# EAGLE design 4relais (EAGLE 5.00)
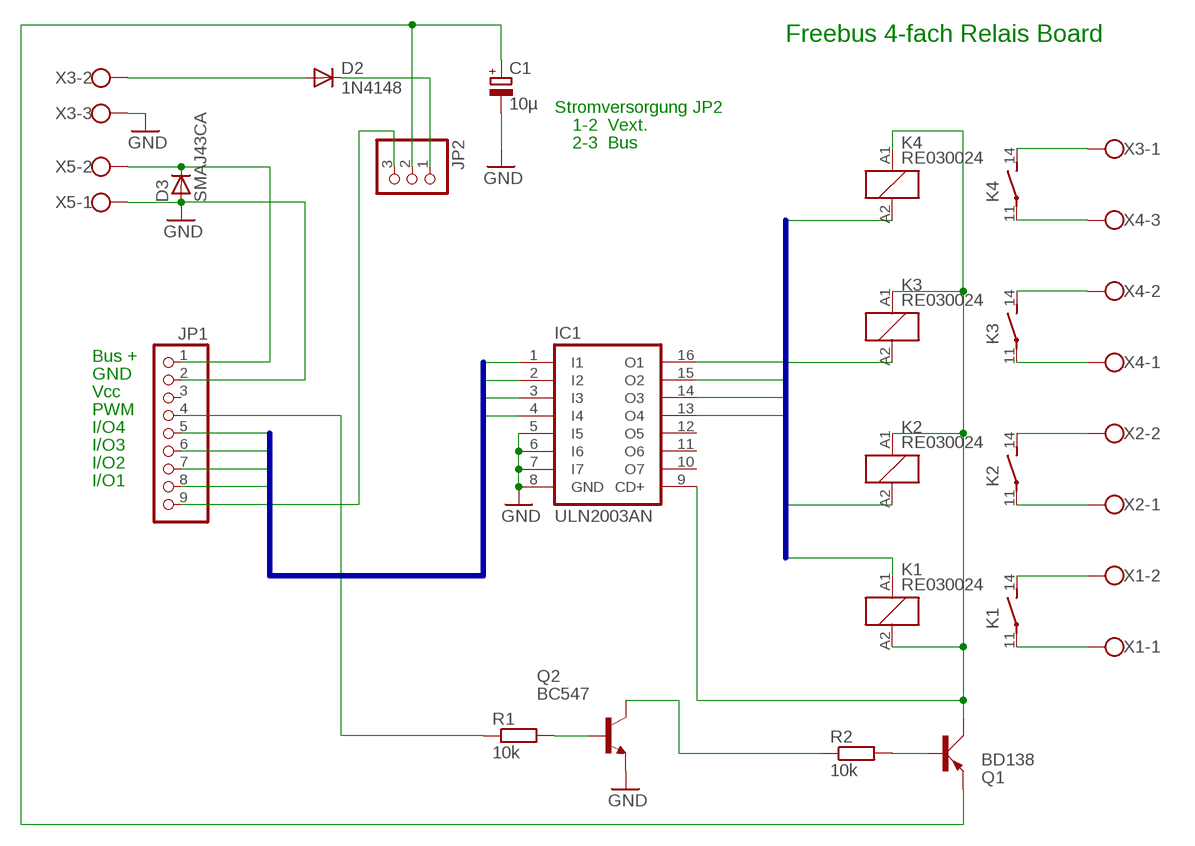
[diagram p0: schematic, sheet 1]

## Parts
C1  10µ  CPOL-EUE3.5-8  [E3,5-8]
D2  1N4148  [DO35-10]
D3  SMAJ43CA  D-SMB  [SMB]
IC1  ULN2003AN  [DIL16]
JP1  PINHD-1X9  [1X09]
JP2  PINHD-1X3  [1X03]
K1  RE030024  [RE-SCHRACK]
K2  RE030024  [RE-SCHRACK]
K3  RE030024  [RE-SCHRACK]
K4  RE030024  [RE-SCHRACK]
Q1  BD138  BD140  [TO126AV]
Q2  BC547  [TO92]
R1  10k  R-EU_0207/10  [0207/10]
R2  10k  R-EU_0207/2V  [0207/2V]
X1  W237-02P  [W237-132]
X2  W237-02P  [W237-132]
X3  W237-3E  [W237-3E]
X4  W237-3E  [W237-3E]
X5  W237-02P  [W237-132]

## Nets
GND: C1.- D3.2(A) IC1.5(I5) IC1.6(I6) IC1.7(I7) IC1.8(GND) JP1.2 Q2.1(E) X3.3 X5.1
IO1: IC1.1(I1) JP1.8
IO2: IC1.2(I2) JP1.7
IO3: IC1.3(I3) JP1.6
IO4: IC1.4(I4) JP1.5
N$1: K1.11(2:P) X1.1
N$2: K1.14(2:S) X1.2
N$3: JP1.9 JP2.3
N$4: D3.1(C) JP1.1 X5.2
N$5: K2.11(2:P) X2.1
N$6: K2.14(2:S) X2.2
N$7: K3.11(2:P) X4.1
N$8: K3.14(2:S) X4.2
N$9: K4.11(2:P) X4.3
N$10: K4.14(2:S) X3.1
N$11: Q2.2(B) R1.2
N$12: JP1.4 R1.1
N$13: D2.A X3.2
N$14: Q2.3(C) R2.1
N$19: IC1.9(CD+) K1.A2 K2.A1 K3.A1 K4.A1 Q1.C
N$31: D2.C JP2.1
N$37: Q1.B R2.2
R1: IC1.16(O1) K1.A1
R2: IC1.15(O2) K2.A2
R3: IC1.14(O3) K3.A2
R4: IC1.13(O4) K4.A2
VDD_IN: C1.+ JP2.2 Q1.E
Unconnected: IC1.10(O7) IC1.11(O6) IC1.12(O5) JP1.3

## Buses
R[1..8]
IO[1..4]

## Notes on the sheet
- Freebus 4-fach Relais Board
- Stromversorgung JP2
- 1-2  Vext.
- 2-3  Bus
- Bus +
- GND
- Vcc
- PWM
- I/O4
- I/O3
- I/O2
- I/O1

## Library data of the parts
C1 = rcl:CPOL-EU: POLARIZED CAPACITOR, European symbol
D2 = diode:1N4148: DIODE high speed (Philips)
D3 = semicon-smd-ipc:D-: DIODE unfilled
IC1 = uln-udn:ULN2003A: DRIVER ARRAY
JP1 = pinhead:PINHD-1X9: PIN HEADER
JP2 = pinhead:PINHD-1X3: PIN HEADER
K1-K4 = relay:RE03*: Miniature PCB Relay 1 pole 6 A SCHRACK Source: http://www.schrack.com/.. 5812.pdf
Q1 = transistor-power:BD140: PNP TRANSISTOR
Q2 = transistor-npn:BC547*: NPN Transistor
R1 R2 = rcl:R-EU_: RESISTOR, European symbol
X1 X2 X5 = con-wago-508:W237-02P: WAGO SREW CLAMP
X3 X4 = con-wago-508:W237-3E: WAGO SREW CLAMP

## Board
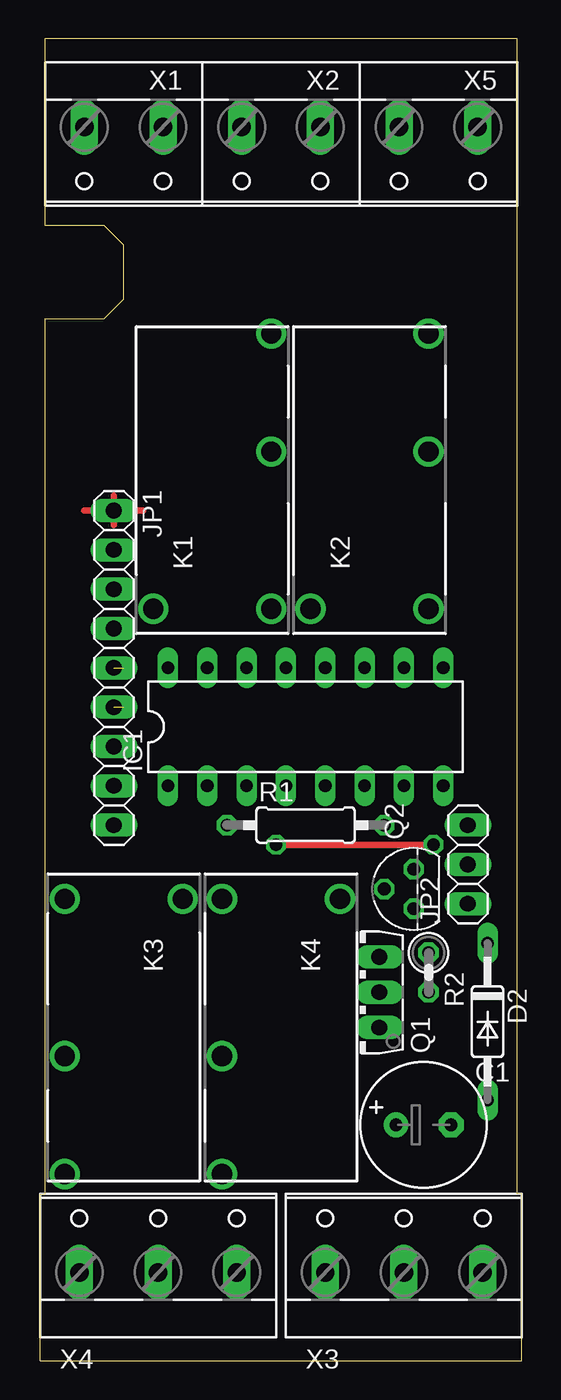
[diagram p1: board, top side]
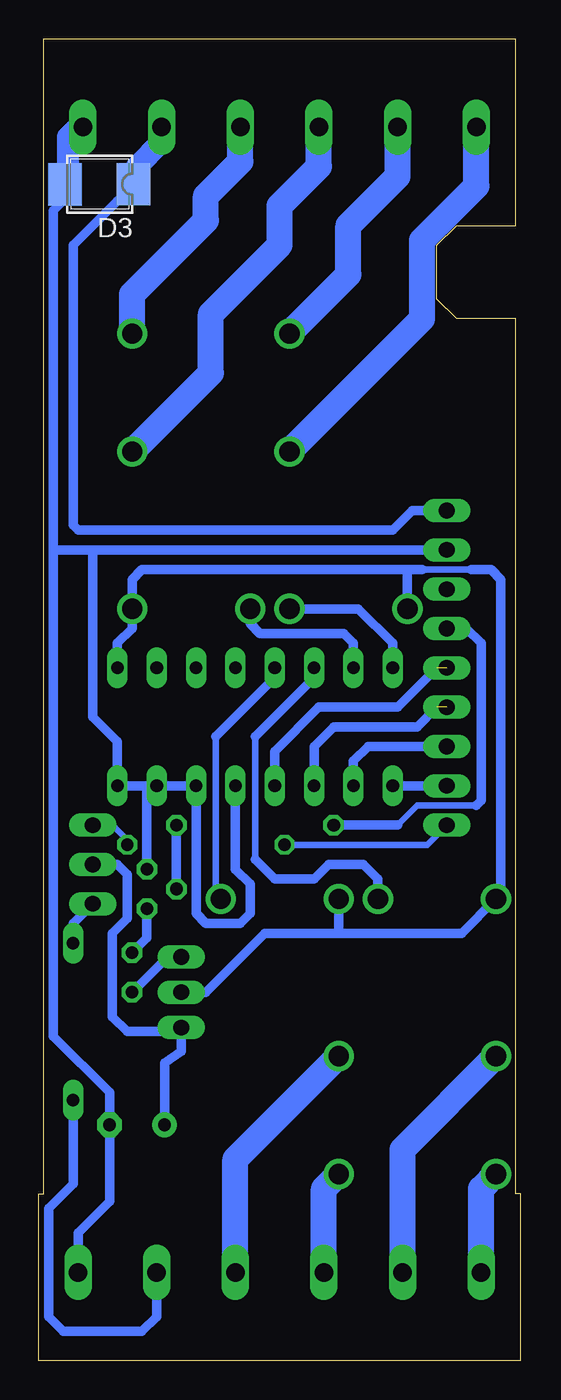
[diagram p2: board, bottom side, seen from below]

Size 31.11 x 85.41 mm. Coordinates in mm from the lower left corner, seen from the top.
Outline: 0,0 0,10.79 0.32,10.79 0.32,67.31 4.13,67.31 5.4,68.58 5.4,72.07 4.13,73.34 0.32,73.34 0.32,85.41 30.8,85.41 30.8,10.79 31.11,10.79 31.11,0 0,0
Copper layers (1*16): Top 0.035mm / dielectric 1.5mm / Bottom 0.035mm
Design rules "default *": minimum track width 10mil, minimum drill 24mil, track to track 12mil, track to pad 12mil, pad to pad 12mil, via to via 12mil, smd to smd 8mil, copper to edge 12mil, drill to drill 8mil, minimum pad ring 10mil, minimum via ring 8mil, stop-mask expansion 4mil, vias tented up to drill 0mil, thermal gap 10mil

### Footprints (pad centres in the part's own frame; a part is rotated, then mirrored left to right if it is on the bottom)
E3,5-8 = drill 0.813 pad 1.6 round: + -1.778,0 | drill 0.813 pad 1.6 octagon: - 1.778,0
DO35-10 = drill 0.813 long: A 5.08,0; C -5.08,0
SMB = smd 2.159 x 2.743: 1 -2.311,-0.127; 2 2.108,-0.102
DIL16 = drill 0.813 long: 1 -8.89,-3.81; 2 -6.35,-3.81; 3 -3.81,-3.81; 4 -1.27,-3.81; 5 1.27,-3.81; 6 3.81,-3.81; 7 6.35,-3.81; 8 8.89,-3.81; 9 8.89,3.81; 10 6.35,3.81; 11 3.81,3.81; 12 1.27,3.81; 13 -1.27,3.81; 14 -3.81,3.81; 15 -6.35,3.81; 16 -8.89,3.81
1X09 = drill 1.016 long: 1 -10.16,0; 2 -7.62,0; 3 -5.08,0; 4 -2.54,0; 5 0,0; 6 2.54,0; 7 5.08,0; 8 7.62,0; 9 10.16,0
1X03 = drill 1.016 long: 1 -2.54,0; 2 0,0; 3 2.54,0
RE-SCHRACK = drill 1.3 round: 11 8.89,-3.81; 14 1.27,-3.81; A1 -8.89,-3.81; A2 -8.89,3.81
TO126AV = drill 1.016 long: B 2.286,-1.27; C 0,-1.27; E -2.286,-1.27
TO92 = drill 0.813 octagon: 1 1.27,0; 2 0,1.905; 3 -1.27,0
0207/10 = drill 0.813 octagon: 1 -5.08,0; 2 5.08,0
0207/2V = drill 0.813 octagon: 1 -1.27,0; 2 1.27,0
W237-132 = drill 1.194 long: 1 -2.54,-0.635; 2 2.54,-0.635
W237-3E = drill 1.194 long: 1 -5.08,-0.635; 2 0,-0.635; 3 5.08,-0.635

### Placement (x,y rotation side)
C1  24.77,15.24 0 top
D2  28.89,21.91 270 top
D3  27.3,75.88 180 bottom
IC1  17.14,40.96 0 top
JP1  4.76,44.77 270 top
JP2  27.62,32.07 90 top
K1  11.11,57.47 90 top
K2  21.27,57.47 90 top
K3  5.4,20.95 270 top
K4  15.56,20.95 270 top
Q1  20.64,23.81 90 top
Q2  24.13,30.48 90 top
R1  17.14,34.61 0 top
R2  25.08,25.08 270 top
X1  5.4,79.06 180 top
X2  15.56,79.06 180 top
X3  23.49,6.35 0 top
X4  7.62,6.35 0 top
X5  25.72,79.06 180 top

### Tracks (layer width: path | path; a pad name or v marks a point on that pad's centre or on a via)
GND
  Bottom 0.61: 30.16,52.39 27.94,52.39 | 27.94,52.39 27.62,52.39 27.62,41.59 26.04,40.01 IC1.8 24.13,37.15 | 30.16,52.39 30.16,20.95 26.54,17.34 C1.- 26.54,10.29 28.58,8.26 X3.3 | D3.2 29.2,75.25 30.16,74.3 30.16,52.39 | 24.13,37.15 IC1.7 IC1.6 20.95,28.89 20.32,28.26 18.1,28.26 17.46,28.89 17.46,30.8 18.42,31.75 IC1.5 | 24.13,37.15 Q2.1 | 27.94,52.39 JP1.2
  Bottom 1.422: X5.1 28.58,79.69 29.21,79.06 29.21,75.88 29.2,75.88 D3.2
IO1
  Bottom 0.61: JP1.8 IC1.1
IO2
  Bottom 0.61: IC1.2 10.79,38.73 9.84,39.69 JP1.7
IO3  (1 unrouted)
  Bottom 0.61: 5.4,42.23 6.67,40.96 12.07,40.96 13.34,39.69 IC1.3
IO4  (1 unrouted)
  Bottom 0.61: 5.4,44.77 7.94,42.23 13.02,42.23 15.87,39.37 IC1.4
N$1
  Bottom 1.676: K1.11 11.11,70.17 11.11,73.34 7.94,76.52 X1.1
N$2
  Bottom 1.676: X1.2 2.86,75.88 6.35,72.39 6.35,67.31 K1.14
N$3  (via drill 0.8 pad 1.27)
  Top 0.406: v15.24,33.34 v25.4,33.34
  Bottom 0.406: v25.4,33.34 25.4,33.66 26.35,34.61 JP2.3 | v15.24,33.34 6.03,33.34 JP1.9
N$4
  Bottom 0.61: D3.1 26.05,74.92 28.89,72.07 28.89,53.98 28.58,53.66 8.26,53.66 6.99,54.93 JP1.1
  Bottom 1.422: D3.1 24.77,77.15 23.18,78.74 X5.2
N$5
  Bottom 1.676: X2.1 18.1,77.47 20.32,75.25 20.32,73.66 25.08,68.9 K2.11
N$6
  Bottom 1.676: X2.2 13.02,77.15 15.56,74.61 15.56,72.07 20,67.63 20,63.82 K2.14
N$7
  Bottom 1.676: X4.1 2.54,11.11 K3.11
N$8
  Bottom 1.676: K3.14 7.62,13.65 X4.2
N$9
  Bottom 1.676: X4.3 12.7,11.11 K4.11
N$10
  Bottom 1.676: X3.1 18.42,13.02 K4.14
N$11
  Bottom 0.61: Q2.2 R1.2
N$12
  Bottom 0.406: 2.86,35.88 6.67,35.88 7.94,34.61
  Bottom 0.61: JP1.4 3.49,47.31 2.54,46.35 2.54,36.2 2.86,35.88 | 7.94,34.61 R1.1
N$13
  Bottom 0.61: D2.A 28.89,11.43 30.48,9.84 30.48,2.86 29.53,1.91 24.45,1.91 23.49,2.86 X3.2
N$14
  Bottom 0.61: R2.1 24.13,27.3 Q2.3
N$15
  Top 0.406: 4.76,53.98 4.76,55.88
N$16
  Top 0.406: 2.86,54.93 6.67,54.93
N$19
  Bottom 0.406: 3.17,51.12 6.35,51.12
  Bottom 0.61: 7.3,51.12 K1.A2 | 11.75,27.62 3.81,27.62 K3.A1 1.27,30.16 1.27,50.48 1.9,51.12 3.17,51.12 | 11.75,27.62 K4.A1 | 11.75,27.62 16.51,27.62 20.32,23.81 Q1.C | 6.35,51.12 7.3,51.12 | 7.3,51.12 24.45,51.12 25.08,50.48 K2.A1 25.08,47.31 26.04,46.35 IC1.9
N$31
  Bottom 0.61: D2.C 28.89,28.26 JP2.1
N$37
  Bottom 0.406: 21.91,26.04 Q1.B
  Bottom 0.61: R2.2 22.86,26.04 21.91,26.04
R1
  Bottom 0.61: IC1.16 8.26,46.35 10.48,48.58 K1.A1
R2
  Bottom 0.61: IC1.15 10.79,46.35 11.43,46.99 16.83,46.99 17.46,47.62 K2.A2
R3
  Bottom 0.406: 17.15,32.38 17.15,40.32
  Bottom 0.61: IC1.14 13.34,44.13 17.15,40.32 | K3.A2 9.21,31.11 10.16,32.07 12.38,32.07 13.34,31.11 15.87,31.11 17.15,32.38
R4
  Bottom 0.406: 19.68,30.16 19.68,40.32
  Bottom 0.61: IC1.13 15.87,44.13 19.68,40.32 | K4.A2 19.68,30.16
VDD_IN
  Bottom 0.61: C1.+ 22.99,19.24 21.91,20 Q1.E 21.91,21.59 22.22,21.27 25.4,21.27 26.35,22.23 26.35,27.62 25.4,28.57 25.4,31.43 26.04,32.07 JP2.2